# Altium project LED-V1.PrjPcb
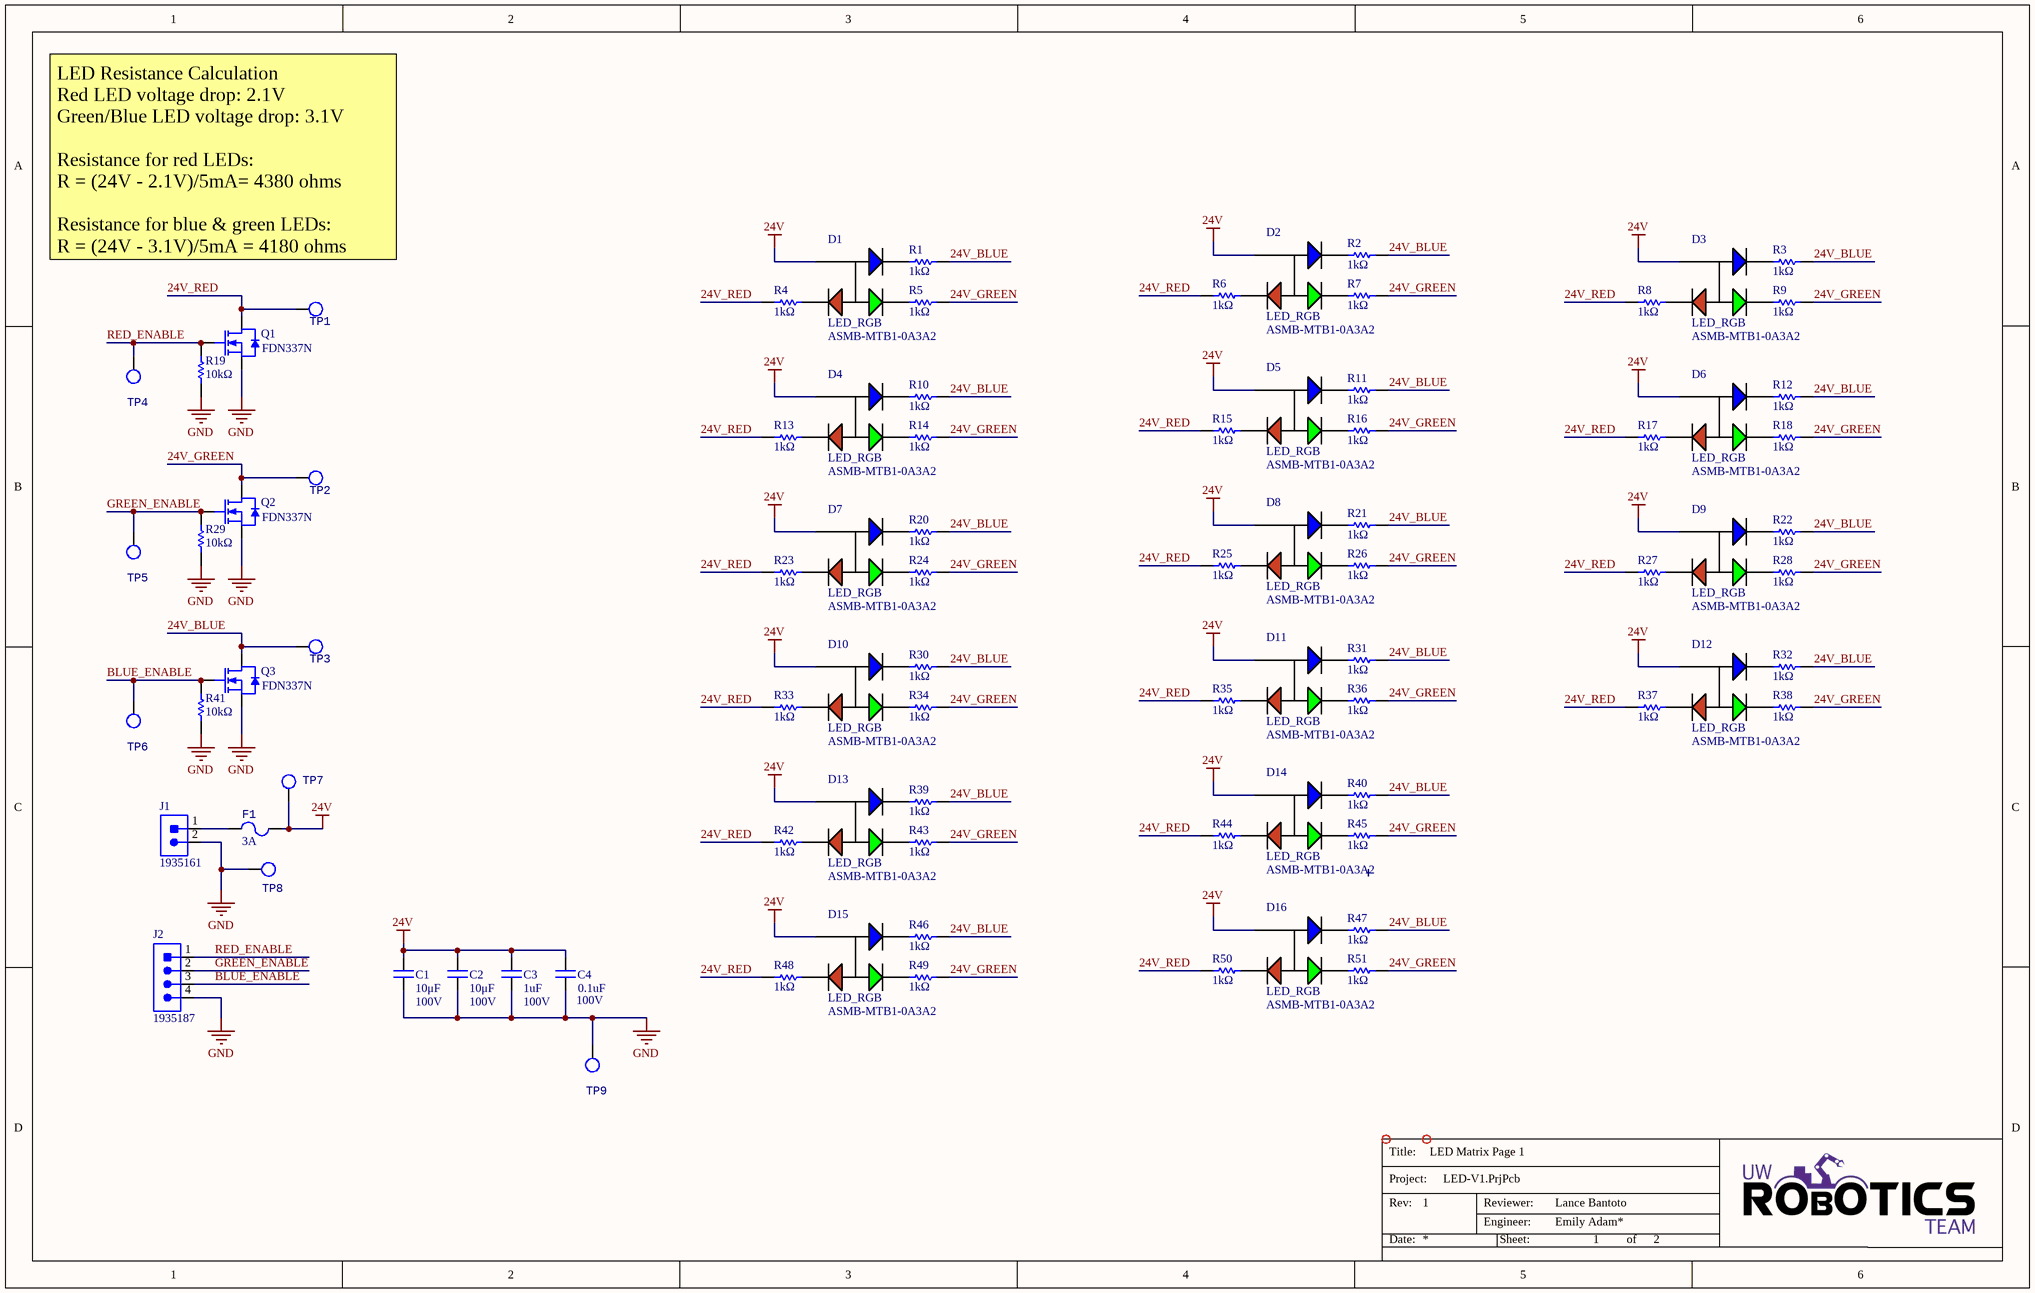
[diagram p0: LED Matrix.SchDoc]
2 sheets, 152 parts. Net scope: global (net labels, ports and power ports of the same name join across sheets).
Board file: LED-V1.PcbDoc
Sheets:
  LED Matrix.SchDoc
  LED Matrix-2.SchDoc

## Sheet LED Matrix.SchDoc: LED Matrix Page 1
size B; CheckedBy: Lance Bantoto; Engineer: Emily Adam*; Revision: 1; SheetNumber: 1; SheetTotal: 2

### Parts
C1  value 10μF  Voltage Rating: 100V  [CAP1210]  (hidden comment: CAP_10uF_100V_1210)
C2  value 10μF  Voltage Rating: 100V  [CAP1210]  (hidden comment: CAP_10uF_100V_1210)
C3  Capacitance: 1uF  Voltage Rating: 100V  [CAPC3216X190X50NL20T25]  (hidden comment: CAP_1uF_100V_1206)
C4  Voltage Rating (DC): 100V  Capacitance: 0.1uF  [CAPC3216X180N]  (hidden comment: CAP_0.1uF_100V_1206)
D1  LED_RGB  Manufacturer Part Number 1: ASMB-MTB1-0A3A2  [LED_RGB]
D2  LED_RGB  Manufacturer Part Number 1: ASMB-MTB1-0A3A2  [LED_RGB]
D3  LED_RGB  Manufacturer Part Number 1: ASMB-MTB1-0A3A2  [LED_RGB]
D4  LED_RGB  Manufacturer Part Number 1: ASMB-MTB1-0A3A2  [LED_RGB]
D5  LED_RGB  Manufacturer Part Number 1: ASMB-MTB1-0A3A2  [LED_RGB]
D6  LED_RGB  Manufacturer Part Number 1: ASMB-MTB1-0A3A2  [LED_RGB]
D7  LED_RGB  Manufacturer Part Number 1: ASMB-MTB1-0A3A2  [LED_RGB]
D8  LED_RGB  Manufacturer Part Number 1: ASMB-MTB1-0A3A2  [LED_RGB]
D9  LED_RGB  Manufacturer Part Number 1: ASMB-MTB1-0A3A2  [LED_RGB]
D10  LED_RGB  Manufacturer Part Number 1: ASMB-MTB1-0A3A2  [LED_RGB]
D11  LED_RGB  Manufacturer Part Number 1: ASMB-MTB1-0A3A2  [LED_RGB]
D12  LED_RGB  Manufacturer Part Number 1: ASMB-MTB1-0A3A2  [LED_RGB]
D13  LED_RGB  Manufacturer Part Number 1: ASMB-MTB1-0A3A2  [LED_RGB]
D14  LED_RGB  Manufacturer Part Number 1: ASMB-MTB1-0A3A2  [LED_RGB]
D15  LED_RGB  Manufacturer Part Number 1: ASMB-MTB1-0A3A2  [LED_RGB]
D16  LED_RGB  Manufacturer Part Number 1: ASMB-MTB1-0A3A2  [LED_RGB]
F1  Current Rating: 3A  [FUSE_1206]  (hidden comment: FUSE_3A_1206)
J1  CON_2M_TERM  [1935161]  (value not drawn)
J2  CON_4M_TERM  [1935187]  (value not drawn)
MH1  MOUNTING_HOLES  [MOUNTING_HOLE]  (value not drawn)
MH2  MOUNTING_HOLES  [MOUNTING_HOLE]  (value not drawn)
Q1  Manufacturer Part Number 1: FDN337N  [NMOS_SSOT-3]  (hidden comment: NMOS_30V_2.2A)
Q2  Manufacturer Part Number 1: FDN337N  [NMOS_SSOT-3]  (hidden comment: NMOS_30V_2.2A)
Q3  Manufacturer Part Number 1: FDN337N  [NMOS_SSOT-3]  (hidden comment: NMOS_30V_2.2A)
R1  1kΩ  [RESC2012X60N]
R2  1kΩ  [RESC2012X60N]
R3  1kΩ  [RESC2012X60N]
R4  1kΩ  [RESC2012X60N]
R5  1kΩ  [RESC2012X60N]
R6  1kΩ  [RESC2012X60N]
R7  1kΩ  [RESC2012X60N]
R8  1kΩ  [RESC2012X60N]
R9  1kΩ  [RESC2012X60N]
R10  1kΩ  [RESC2012X60N]
R11  1kΩ  [RESC2012X60N]
R12  1kΩ  [RESC2012X60N]
R13  1kΩ  [RESC2012X60N]
R14  1kΩ  [RESC2012X60N]
R15  1kΩ  [RESC2012X60N]
R16  1kΩ  [RESC2012X60N]
R17  1kΩ  [RESC2012X60N]
R18  1kΩ  [RESC2012X60N]
R19  value 10kΩ  [RESC2012X60N]  (hidden comment: RES_10kΩ_0805)
R20  1kΩ  [RESC2012X60N]
R21  1kΩ  [RESC2012X60N]
R22  1kΩ  [RESC2012X60N]
R23  1kΩ  [RESC2012X60N]
R24  1kΩ  [RESC2012X60N]
R25  1kΩ  [RESC2012X60N]
R26  1kΩ  [RESC2012X60N]
R27  1kΩ  [RESC2012X60N]
R28  1kΩ  [RESC2012X60N]
R29  value 10kΩ  [RESC2012X60N]  (hidden comment: RES_10kΩ_0805)
R30  1kΩ  [RESC2012X60N]
R31  1kΩ  [RESC2012X60N]
R32  1kΩ  [RESC2012X60N]
R33  1kΩ  [RESC2012X60N]
R34  1kΩ  [RESC2012X60N]
R35  1kΩ  [RESC2012X60N]
R36  1kΩ  [RESC2012X60N]
R37  1kΩ  [RESC2012X60N]
R38  1kΩ  [RESC2012X60N]
R39  1kΩ  [RESC2012X60N]
R40  1kΩ  [RESC2012X60N]
R41  value 10kΩ  [RESC2012X60N]  (hidden comment: RES_10kΩ_0805)
R42  1kΩ  [RESC2012X60N]
R43  1kΩ  [RESC2012X60N]
R44  1kΩ  [RESC2012X60N]
R45  1kΩ  [RESC2012X60N]
R46  1kΩ  [RESC2012X60N]
R47  1kΩ  [RESC2012X60N]
R48  1kΩ  [RESC2012X60N]
R49  1kΩ  [RESC2012X60N]
R50  1kΩ  [RESC2012X60N]
R51  1kΩ  [RESC2012X60N]
TP1  TESTPOINT_LOOP  [TESTPOINT_LOOP]  (value not drawn)
TP2  TESTPOINT_LOOP  [TESTPOINT_LOOP]  (value not drawn)
TP3  TESTPOINT_LOOP  [TESTPOINT_LOOP]  (value not drawn)
TP4  TESTPOINT_LOOP  [TESTPOINT_LOOP]  (value not drawn)
TP5  TESTPOINT_LOOP  [TESTPOINT_LOOP]  (value not drawn)
TP6  TESTPOINT_LOOP  [TESTPOINT_LOOP]  (value not drawn)
TP7  TESTPOINT_LOOP  [TESTPOINT_LOOP]  (value not drawn)
TP8  TESTPOINT_LOOP  [TESTPOINT_LOOP]  (value not drawn)
TP9  TESTPOINT_LOOP  [TESTPOINT_LOOP]  (value not drawn)

### Nets
24V: C1.2 C2.2 C3.1 C4.2 D1.4(COMMON_ANODE) D2.4(COMMON_ANODE) D3.4(COMMON_ANODE) D4.4(COMMON_ANODE) D5.4(COMMON_ANODE) D6.4(COMMON_ANODE) D7.4(COMMON_ANODE) D8.4(COMMON_ANODE) D9.4(COMMON_ANODE) D10.4(COMMON_ANODE) D11.4(COMMON_ANODE) D12.4(COMMON_ANODE) D13.4(COMMON_ANODE) D14.4(COMMON_ANODE) D15.4(COMMON_ANODE) D16.4(COMMON_ANODE) F1.1 TP7.1
GND: C1.1 C2.1 C3.2 C4.1 J1.2 J2.4 Q1.2(SOURCE) Q2.2(SOURCE) Q3.2(SOURCE) R19.1 R29.1 R41.1 TP8.1 TP9.1
24V_BLUE: Q3.3(DRAIN) R1.2 R2.2 R3.2 R10.2 R11.2 R12.2 R20.1 R21.1 R22.1 R30.2 R31.2 R32.2 R39.1 R40.2 R46.2 R47.2 TP3.1
24V_GREEN: Q2.3(DRAIN) R5.2 R7.2 R9.2 R14.2 R16.2 R18.2 R24.2 R26.2 R28.2 R34.2 R36.2 R38.2 R43.2 R45.2 R49.2 R51.2 TP2.1
24V_RED: Q1.3(DRAIN) R4.1 R6.1 R8.1 R13.1 R15.1 R17.1 R23.2 R25.1 R27.1 R33.1 R35.1 R37.1 R42.1 R44.1 R48.1 R50.1 TP1.1
BLUE_ENABLE: J2.3 Q3.1(GATE) R41.2 TP6.1
GREEN_ENABLE: J2.2 Q2.1(GATE) R29.2 TP5.1
RED_ENABLE: J2.1 Q1.1(GATE) R19.2 TP4.1
NetD1_1: D1.1(CATHODE_(RED)) R4.2
NetD1_2: D1.2(CATHODE_(GREEN)) R5.1
NetD1_3: D1.3(CATHODE_(BLUE)) R1.1
NetD2_1: D2.1(CATHODE_(RED)) R6.2
NetD2_2: D2.2(CATHODE_(GREEN)) R7.1
NetD2_3: D2.3(CATHODE_(BLUE)) R2.1
NetD3_1: D3.1(CATHODE_(RED)) R8.2
NetD3_2: D3.2(CATHODE_(GREEN)) R9.1
NetD3_3: D3.3(CATHODE_(BLUE)) R3.1
NetD4_1: D4.1(CATHODE_(RED)) R13.2
NetD4_2: D4.2(CATHODE_(GREEN)) R14.1
NetD4_3: D4.3(CATHODE_(BLUE)) R10.1
NetD5_1: D5.1(CATHODE_(RED)) R15.2
NetD5_2: D5.2(CATHODE_(GREEN)) R16.1
NetD5_3: D5.3(CATHODE_(BLUE)) R11.1
NetD6_1: D6.1(CATHODE_(RED)) R17.2
NetD6_2: D6.2(CATHODE_(GREEN)) R18.1
NetD6_3: D6.3(CATHODE_(BLUE)) R12.1
NetD7_1: D7.1(CATHODE_(RED)) R23.1
NetD7_2: D7.2(CATHODE_(GREEN)) R24.1
NetD7_3: D7.3(CATHODE_(BLUE)) R20.2
NetD8_1: D8.1(CATHODE_(RED)) R25.2
NetD8_2: D8.2(CATHODE_(GREEN)) R26.1
NetD8_3: D8.3(CATHODE_(BLUE)) R21.2
NetD9_1: D9.1(CATHODE_(RED)) R27.2
NetD9_2: D9.2(CATHODE_(GREEN)) R28.1
NetD9_3: D9.3(CATHODE_(BLUE)) R22.2
NetD10_1: D10.1(CATHODE_(RED)) R33.2
NetD10_2: D10.2(CATHODE_(GREEN)) R34.1
NetD10_3: D10.3(CATHODE_(BLUE)) R30.1
NetD11_1: D11.1(CATHODE_(RED)) R35.2
NetD11_2: D11.2(CATHODE_(GREEN)) R36.1
NetD11_3: D11.3(CATHODE_(BLUE)) R31.1
NetD12_1: D12.1(CATHODE_(RED)) R37.2
NetD12_2: D12.2(CATHODE_(GREEN)) R38.1
NetD12_3: D12.3(CATHODE_(BLUE)) R32.1
NetD13_1: D13.1(CATHODE_(RED)) R42.2
NetD13_2: D13.2(CATHODE_(GREEN)) R43.1
NetD13_3: D13.3(CATHODE_(BLUE)) R39.2
NetD14_1: D14.1(CATHODE_(RED)) R44.2
NetD14_2: D14.2(CATHODE_(GREEN)) R45.1
NetD14_3: D14.3(CATHODE_(BLUE)) R40.1
NetD15_1: D15.1(CATHODE_(RED)) R48.2
NetD15_2: D15.2(CATHODE_(GREEN)) R49.1
NetD15_3: D15.3(CATHODE_(BLUE)) R46.1
NetD16_1: D16.1(CATHODE_(RED)) R50.2
NetD16_2: D16.2(CATHODE_(GREEN)) R51.1
NetD16_3: D16.3(CATHODE_(BLUE)) R47.1
NetF1_2: F1.2 J1.1

### Notes on the sheet
- LED Resistance Calculation
  Red LED voltage drop: 2.1V
  Green/Blue LED voltage drop: 3.1V
  Resistance for red LEDs:
  R = (24V - 2.1V)/5mA= 4380 ohms
  Resistance for blue & green LEDs:
  R = (24V - 3.1V)/5mA = 4180 ohms
- Title:
- Project:
- Date:
- Rev:
- Reviewer:
- Engineer:
- Sheet:
- of

### Library data of the parts
C1 C2 = CAP_10uF_100V_1210: CAP CER 10uF 100V X7S 10% 1210; Manufacturer 1: Murata; Manufacturer Part Number 1: GRM32EC72A106KE05L; Package/Footprint: 1210; Supplier 1: Digi-Key; Tolerance: 10%; Supplier Part Number 1: 490-16266-1-ND; Dielectric: X7S; Mounting Type: SMD
C3 = CAP_1uF_100V_1206: CAP CER 1UF 100V X7R 1206; Manufacturer: Murata; Manufacturer Part Number: GCJ31CR72A105KA01L; Package/Footprint: 1206; Supplier 1: Digi-Key; Supplier Part Number 1: 490-16468-1-ND; Mounting Type: SMD
C4 = CAP_0.1uF_100V_1206: CAP CER 0.1UF 100V C0G/NP0 1206; Manufacturer: Murata; Manufacturer Part Number: GRM31C5C2A104JA01L; Dielectric: C0G; Tolerance: 5%; Supplier 1: Digi-Key; RoHS: No; Category: Ceramic Capacitors; Stock 1: 18337; Pricing 1: 1=0.69000, 10=0.48900, 50=0.36940, 100=0.32180, 500=0.23838, 1000=0.20261 (USD); Length: 3.2mm; Width: 1.6mm; Thickness: 1.6mm; ComponentLink1URL: https://psearch.en.murata.com:443/capacitor/product/GRM31C5C2A104JA01%23.pdf?src-supplier=IHS+Markit; ComponentLink1Description: https://psearch.en.murata.com:443/capacitor/product/GRM31C5C2A104JA01%23.pdf?src-supplier=IHS+Markit; ComponentLink2URL: https://search.murata.co.jp/Ceramy/image/img/A01X/G101/ENG/GRM31C5C2A104JA01-01.pdf?src-supplier=Digi-Key; ComponentLink2Description: https://search.murata.co.jp/Ceramy/image/img/A01X/G101/ENG/GRM31C5C2A104JA01-01.pdf?src-supplier=Digi-Key; ComponentLink3URL: http://search.murata.co.jp/Ceramy/image/img/A01X/G101/ENG/GRM31C5C2A104JA01-01.pdf?src-supplier=Digi-Key; ComponentLink3Description: http://search.murata.co.jp/Ceramy/image/img/A01X/G101/ENG/GRM31C5C2A104JA01-01.pdf?src-supplier=Digi-Key; Supplier Part Number 1: 490-16315-1-ND
D1-D16 = LED_RGB: LED RGB DIFFUSED 4PLCC SMD; Manufacturer 1: Broadcom; Color: Blue,Green,Red; Lens Color: White; Viewing Angle: 115°; Lens Style: Round; Luminous Intensity: 350mcd; Dominant Wavelength: 470nm; Forward Voltage: 3.1V; Test Current: 20mA; Package/Footprint: 4-PLCC; Supplier 1: Digi-Key; Case/Package: PLCC; Number of Pins: 4; Lens Transparency: Diffused; Length: 3.2mm; Height: 1.9mm; Width: 2.8mm; Supplier Part Number 1: 516-3280-1-ND; Mounting Type: SMD
F1 = FUSE_3A_1206: FUSE BOARD MNT 3A 32VAC/VDC 1206; Manufacturer 1: Littelfuse; Manufacturer Part Number 1: 0466003.NR; Working Voltage: 32V; Response Time: Fast Blow; Package/Footprint: 1206; Supplier 1: Digi-Key; Supplier Part Number 1: F1458CT-ND; Mounting Type: SMD
J1 = CON_2M_TERM: TERM BLK 2POS SIDE ENTRY 5MM; Manufacturer 1: Phoenix Contact; Max Current Rating: 16A; Current: 18A; Voltage: 300V; Package/Footprint: SMD; Supplier 1: Digi-Key; Supplier Part Number 1: 277-1667-ND; Manufacturer Part Number 1: 1935161; Mounting Type: TH
J2 = CON_4M_TERM: TERM BLK 4POS SIDE ENTRY 5MM PCB; Manufacturer 1: Phoenix Contact; Current: 18A; Voltage: 300V; Wire Gauge: 12-26AWG; Screw Thread: M2.6; Package/Footprint: TH; Supplier Part Number 1: 277-1579-ND; Supplier 1: Digi-Key; Pitch: 5mm; Mounting Type: TH; Manufacturer Part Number 1: 1935187
MH1 MH2 = MOUNTING_HOLES: 6cm x 6cm
Q1-Q3 = NMOS_30V_2.2A: MOSFET N-CH 30V 2.2A SUPERSOT3; Manufacturer 1: ON Semiconductor / Fairchild; Element Configuration: Single; Drain to Source Resistance: 65mR; Turn-Off Delay Time: 17ns; Gate to Source Voltage (Vgs): 8V; Rise Time: 10ns; Max Power Dissipation: 500mW; Fall Time: 4ns; Input Capacitance: 300pF; Number of Elements: 1; Threshold Voltage: 700mV; Package/Footprint: SuperSOT-3; Supplier 1: Digi-Key; Category: MOSFETs; Max Operating Temperature: 150°C; Continuous Drain Current (ID): 2.2A; Drain to Source Breakdown Voltage: 30V; Power Dissipation: 500mW; Turn-On Delay Time: 4ns; Rds On Max: 65mR; Drain to Source Voltage (Vdss): 30V; On-State Resistance: 65mR; Voltage Rating (DC): 30V; Current Rating: 2.2A; Dual Supply Voltage: 30V; Nominal Vgs: 700mV; Supplier Part Number 1: FDN337NCT-ND; Mounting Type: SMD
R1-R18 R20-R28 R30-R40 R42-R51 = RES_1kΩ_0805: RES SMD 1K OHM 1% 1/8W 0805; Manufacturer 1: Yageo; Manufacturer Part Number 1: RC0805FR-071KL; Power Rating: 125mW; Temperature Coefficient: 25ppm/°C; Voltage Rating: 150V; Supplier 1: Digi-Key; Case Code (Imperial): 0805; Case Code (Metric): 2012; Min Operating Temperature: -55°C; Max Operating Temperature: 155°C; Resistance: 1K; Tolerance: 1%; Termination: SMD/SMT; Supplier Part Number 1: 311-1.00KCRCT-ND; Value: 1kΩ; Package: 0805 (2012 Metric); Mount: Surface Mount; Case/Package: 0805; Number of Pins: 2; Weight: 0.000194oz; Contact Plating: Tin; Composition: Thin Film; Number of Terminations: 2; Voltage Rating (DC): 150V; Max Power Dissipation: 125mW; Features: Moisture Resistant,Automotive AEC-Q200,Anti-Sulfur; Military Standard: Not; Length: 2mm; Height: 0.022inch; Width: 0.049inch; Depth: 1.25mm; REACH SVHC: Unknown
R19 R29 R41 = RES_10kΩ_0805: RES SMD 10K OHM 1% 1/8W 0805; Manufacturer 1: Yageo; Manufacturer Part Number 1: RC0805FR-0710KL; Power Rating: 125mW; Supplier 1: Digi-Key; Case Code (Metric): 2012; Min Operating Temperature: -55°C; Max Operating Temperature: 155°C; Resistance: 10K; Tolerance: 1%; Termination: SMD/SMT; Supplier Part Number 1: 311-10.0KCRCT-ND; Package: 0805 (2012 Metric); Case Code (Imperial): 0805
TP1-TP9 = TESTPOINT_LOOP: PC TEST POINT MINIATURE WHITE; Manufacturer 1: Keystone Electronics; Manufacturer Part Number 1: 5002; Package/Footprint: TH; Supplier Part Number 1: 36-5002-ND; Supplier 1: Digi-Key; Mounting Type: TH

## Sheet LED Matrix-2.SchDoc: LED Matrix Page 2
size B; CheckedBy: Lance Bantoto; Engineer: Emily Adam; Revision: 1; SheetNumber: 2; SheetTotal: 2
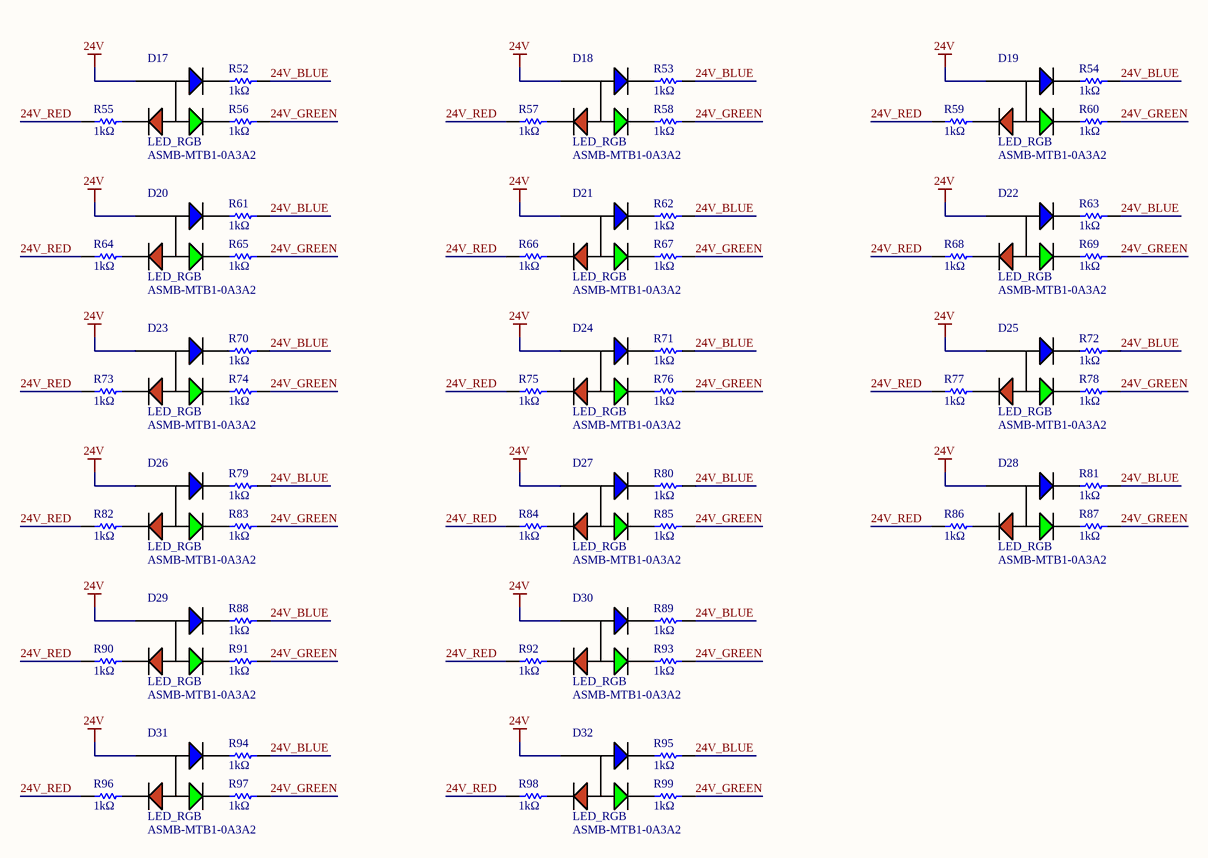
[diagram p1: LED Matrix-2.SchDoc]

### Parts
D17  LED_RGB  Manufacturer Part Number 1: ASMB-MTB1-0A3A2  [LED_RGB]
D18  LED_RGB  Manufacturer Part Number 1: ASMB-MTB1-0A3A2  [LED_RGB]
D19  LED_RGB  Manufacturer Part Number 1: ASMB-MTB1-0A3A2  [LED_RGB]
D20  LED_RGB  Manufacturer Part Number 1: ASMB-MTB1-0A3A2  [LED_RGB]
D21  LED_RGB  Manufacturer Part Number 1: ASMB-MTB1-0A3A2  [LED_RGB]
D22  LED_RGB  Manufacturer Part Number 1: ASMB-MTB1-0A3A2  [LED_RGB]
D23  LED_RGB  Manufacturer Part Number 1: ASMB-MTB1-0A3A2  [LED_RGB]
D24  LED_RGB  Manufacturer Part Number 1: ASMB-MTB1-0A3A2  [LED_RGB]
D25  LED_RGB  Manufacturer Part Number 1: ASMB-MTB1-0A3A2  [LED_RGB]
D26  LED_RGB  Manufacturer Part Number 1: ASMB-MTB1-0A3A2  [LED_RGB]
D27  LED_RGB  Manufacturer Part Number 1: ASMB-MTB1-0A3A2  [LED_RGB]
D28  LED_RGB  Manufacturer Part Number 1: ASMB-MTB1-0A3A2  [LED_RGB]
D29  LED_RGB  Manufacturer Part Number 1: ASMB-MTB1-0A3A2  [LED_RGB]
D30  LED_RGB  Manufacturer Part Number 1: ASMB-MTB1-0A3A2  [LED_RGB]
D31  LED_RGB  Manufacturer Part Number 1: ASMB-MTB1-0A3A2  [LED_RGB]
D32  LED_RGB  Manufacturer Part Number 1: ASMB-MTB1-0A3A2  [LED_RGB]
R52  1kΩ  [RESC2012X60N]
R53  1kΩ  [RESC2012X60N]
R54  1kΩ  [RESC2012X60N]
R55  1kΩ  [RESC2012X60N]
R56  1kΩ  [RESC2012X60N]
R57  1kΩ  [RESC2012X60N]
R58  1kΩ  [RESC2012X60N]
R59  1kΩ  [RESC2012X60N]
R60  1kΩ  [RESC2012X60N]
R61  1kΩ  [RESC2012X60N]
R62  1kΩ  [RESC2012X60N]
R63  1kΩ  [RESC2012X60N]
R64  1kΩ  [RESC2012X60N]
R65  1kΩ  [RESC2012X60N]
R66  1kΩ  [RESC2012X60N]
R67  1kΩ  [RESC2012X60N]
R68  1kΩ  [RESC2012X60N]
R69  1kΩ  [RESC2012X60N]
R70  1kΩ  [RESC2012X60N]
R71  1kΩ  [RESC2012X60N]
R72  1kΩ  [RESC2012X60N]
R73  1kΩ  [RESC2012X60N]
R74  1kΩ  [RESC2012X60N]
R75  1kΩ  [RESC2012X60N]
R76  1kΩ  [RESC2012X60N]
R77  1kΩ  [RESC2012X60N]
R78  1kΩ  [RESC2012X60N]
R79  1kΩ  [RESC2012X60N]
R80  1kΩ  [RESC2012X60N]
R81  1kΩ  [RESC2012X60N]
R82  1kΩ  [RESC2012X60N]
R83  1kΩ  [RESC2012X60N]
R84  1kΩ  [RESC2012X60N]
R85  1kΩ  [RESC2012X60N]
R86  1kΩ  [RESC2012X60N]
R87  1kΩ  [RESC2012X60N]
R88  1kΩ  [RESC2012X60N]
R89  1kΩ  [RESC2012X60N]
R90  1kΩ  [RESC2012X60N]
R91  1kΩ  [RESC2012X60N]
R92  1kΩ  [RESC2012X60N]
R93  1kΩ  [RESC2012X60N]
R94  1kΩ  [RESC2012X60N]
R95  1kΩ  [RESC2012X60N]
R96  1kΩ  [RESC2012X60N]
R97  1kΩ  [RESC2012X60N]
R98  1kΩ  [RESC2012X60N]
R99  1kΩ  [RESC2012X60N]

### Nets
24V: D17.4(COMMON_ANODE) D18.4(COMMON_ANODE) D19.4(COMMON_ANODE) D20.4(COMMON_ANODE) D21.4(COMMON_ANODE) D22.4(COMMON_ANODE) D23.4(COMMON_ANODE) D24.4(COMMON_ANODE) D25.4(COMMON_ANODE) D26.4(COMMON_ANODE) D27.4(COMMON_ANODE) D28.4(COMMON_ANODE) D29.4(COMMON_ANODE) D30.4(COMMON_ANODE) D31.4(COMMON_ANODE) D32.4(COMMON_ANODE)
24V_BLUE: R52.2 R53.2 R54.2 R61.2 R62.2 R63.2 R70.2 R71.2 R72.2 R79.2 R80.2 R81.2 R88.2 R89.2 R94.2 R95.2
24V_GREEN: R56.2 R58.2 R60.2 R65.2 R67.2 R69.2 R74.2 R76.2 R78.2 R83.2 R85.2 R87.2 R91.2 R93.2 R97.2 R99.2
24V_RED: R55.1 R57.1 R59.1 R64.1 R66.1 R68.1 R73.1 R75.1 R77.1 R82.1 R84.1 R86.1 R90.1 R92.1 R96.1 R98.1
NetD17_1: D17.1(CATHODE_(RED)) R55.2
NetD17_2: D17.2(CATHODE_(GREEN)) R56.1
NetD17_3: D17.3(CATHODE_(BLUE)) R52.1
NetD18_1: D18.1(CATHODE_(RED)) R57.2
NetD18_2: D18.2(CATHODE_(GREEN)) R58.1
NetD18_3: D18.3(CATHODE_(BLUE)) R53.1
NetD19_1: D19.1(CATHODE_(RED)) R59.2
NetD19_2: D19.2(CATHODE_(GREEN)) R60.1
NetD19_3: D19.3(CATHODE_(BLUE)) R54.1
NetD20_1: D20.1(CATHODE_(RED)) R64.2
NetD20_2: D20.2(CATHODE_(GREEN)) R65.1
NetD20_3: D20.3(CATHODE_(BLUE)) R61.1
NetD21_1: D21.1(CATHODE_(RED)) R66.2
NetD21_2: D21.2(CATHODE_(GREEN)) R67.1
NetD21_3: D21.3(CATHODE_(BLUE)) R62.1
NetD22_1: D22.1(CATHODE_(RED)) R68.2
NetD22_2: D22.2(CATHODE_(GREEN)) R69.1
NetD22_3: D22.3(CATHODE_(BLUE)) R63.1
NetD23_1: D23.1(CATHODE_(RED)) R73.2
NetD23_2: D23.2(CATHODE_(GREEN)) R74.1
NetD23_3: D23.3(CATHODE_(BLUE)) R70.1
NetD24_1: D24.1(CATHODE_(RED)) R75.2
NetD24_2: D24.2(CATHODE_(GREEN)) R76.1
NetD24_3: D24.3(CATHODE_(BLUE)) R71.1
NetD25_1: D25.1(CATHODE_(RED)) R77.2
NetD25_2: D25.2(CATHODE_(GREEN)) R78.1
NetD25_3: D25.3(CATHODE_(BLUE)) R72.1
NetD26_1: D26.1(CATHODE_(RED)) R82.2
NetD26_2: D26.2(CATHODE_(GREEN)) R83.1
NetD26_3: D26.3(CATHODE_(BLUE)) R79.1
NetD27_1: D27.1(CATHODE_(RED)) R84.2
NetD27_2: D27.2(CATHODE_(GREEN)) R85.1
NetD27_3: D27.3(CATHODE_(BLUE)) R80.1
NetD28_1: D28.1(CATHODE_(RED)) R86.2
NetD28_2: D28.2(CATHODE_(GREEN)) R87.1
NetD28_3: D28.3(CATHODE_(BLUE)) R81.1
NetD29_1: D29.1(CATHODE_(RED)) R90.2
NetD29_2: D29.2(CATHODE_(GREEN)) R91.1
NetD29_3: D29.3(CATHODE_(BLUE)) R88.1
NetD30_1: D30.1(CATHODE_(RED)) R92.2
NetD30_2: D30.2(CATHODE_(GREEN)) R93.1
NetD30_3: D30.3(CATHODE_(BLUE)) R89.1
NetD31_1: D31.1(CATHODE_(RED)) R96.2
NetD31_2: D31.2(CATHODE_(GREEN)) R97.1
NetD31_3: D31.3(CATHODE_(BLUE)) R94.1
NetD32_1: D32.1(CATHODE_(RED)) R98.2
NetD32_2: D32.2(CATHODE_(GREEN)) R99.1
NetD32_3: D32.3(CATHODE_(BLUE)) R95.1

### Notes on the sheet
- Title:
- Project:
- Date:
- Rev:
- Checker:
- Engineer:
- Sheet:
- of

### Library data of the parts
D17-D32 = LED_RGB: LED RGB DIFFUSED 4PLCC SMD; Manufacturer 1: Broadcom; Color: Blue,Green,Red; Lens Color: White; Viewing Angle: 115°; Lens Style: Round; Luminous Intensity: 350mcd; Dominant Wavelength: 470nm; Forward Voltage: 3.1V; Test Current: 20mA; Supplier 1: Digi-Key; Mount: Surface Mount; Case/Package: PLCC; Number of Pins: 4; Lens Transparency: Diffused; Length: 3.2mm; Height: 1.9mm; Width: 2.8mm; REACH SVHC: No SVHC; Supplier Part Number 1: 516-3280-1-ND
R52-R99 = RES_1kΩ_0805: as R1 on sheet LED Matrix; Supplier 1: Digi-Key; Case Code (Metric): 2012; Min Operating Temperature: -55°C; Max Operating Temperature: 155°C; Resistance: 1K; Tolerance: 1%; Termination: SMD/SMT; Supplier Part Number 1: 311-1.00KCRCT-ND; Case Code (Imperial): 0805; Value: 1kΩ; Package: 0805 (2012 Metric); Mount: Surface Mount; Case/Package: 0805; Number of Pins: 2; Weight: 0.000194oz; Contact Plating: Tin; Composition: Thin Film; Number of Terminations: 2; Voltage Rating (DC): 150V; Max Power Dissipation: 125mW; Features: Moisture Resistant,Automotive AEC-Q200,Anti-Sulfur; Military Standard: Not; Length: 2mm; Height: 0.022inch; Width: 0.049inch; Depth: 1.25mm; REACH SVHC: Unknown

## Nets that join several sheets
24V: LED Matrix (22 pins), LED Matrix-2 (16 pins)
24V_BLUE: LED Matrix (18 pins), LED Matrix-2 (16 pins)
24V_GREEN: LED Matrix (18 pins), LED Matrix-2 (16 pins)
24V_RED: LED Matrix (18 pins), LED Matrix-2 (16 pins)